# Altium schematic sheet TEC_CONTROLLER_3.SchDoc: Laser PCB
size A3; DrawnBy: James Singleton; Organization: TMC Technology Ltd.; DocumentNumber: 13; Revision: A; SheetNumber: 12; SheetTotal: 18; Drawn Date: 22/12/2020
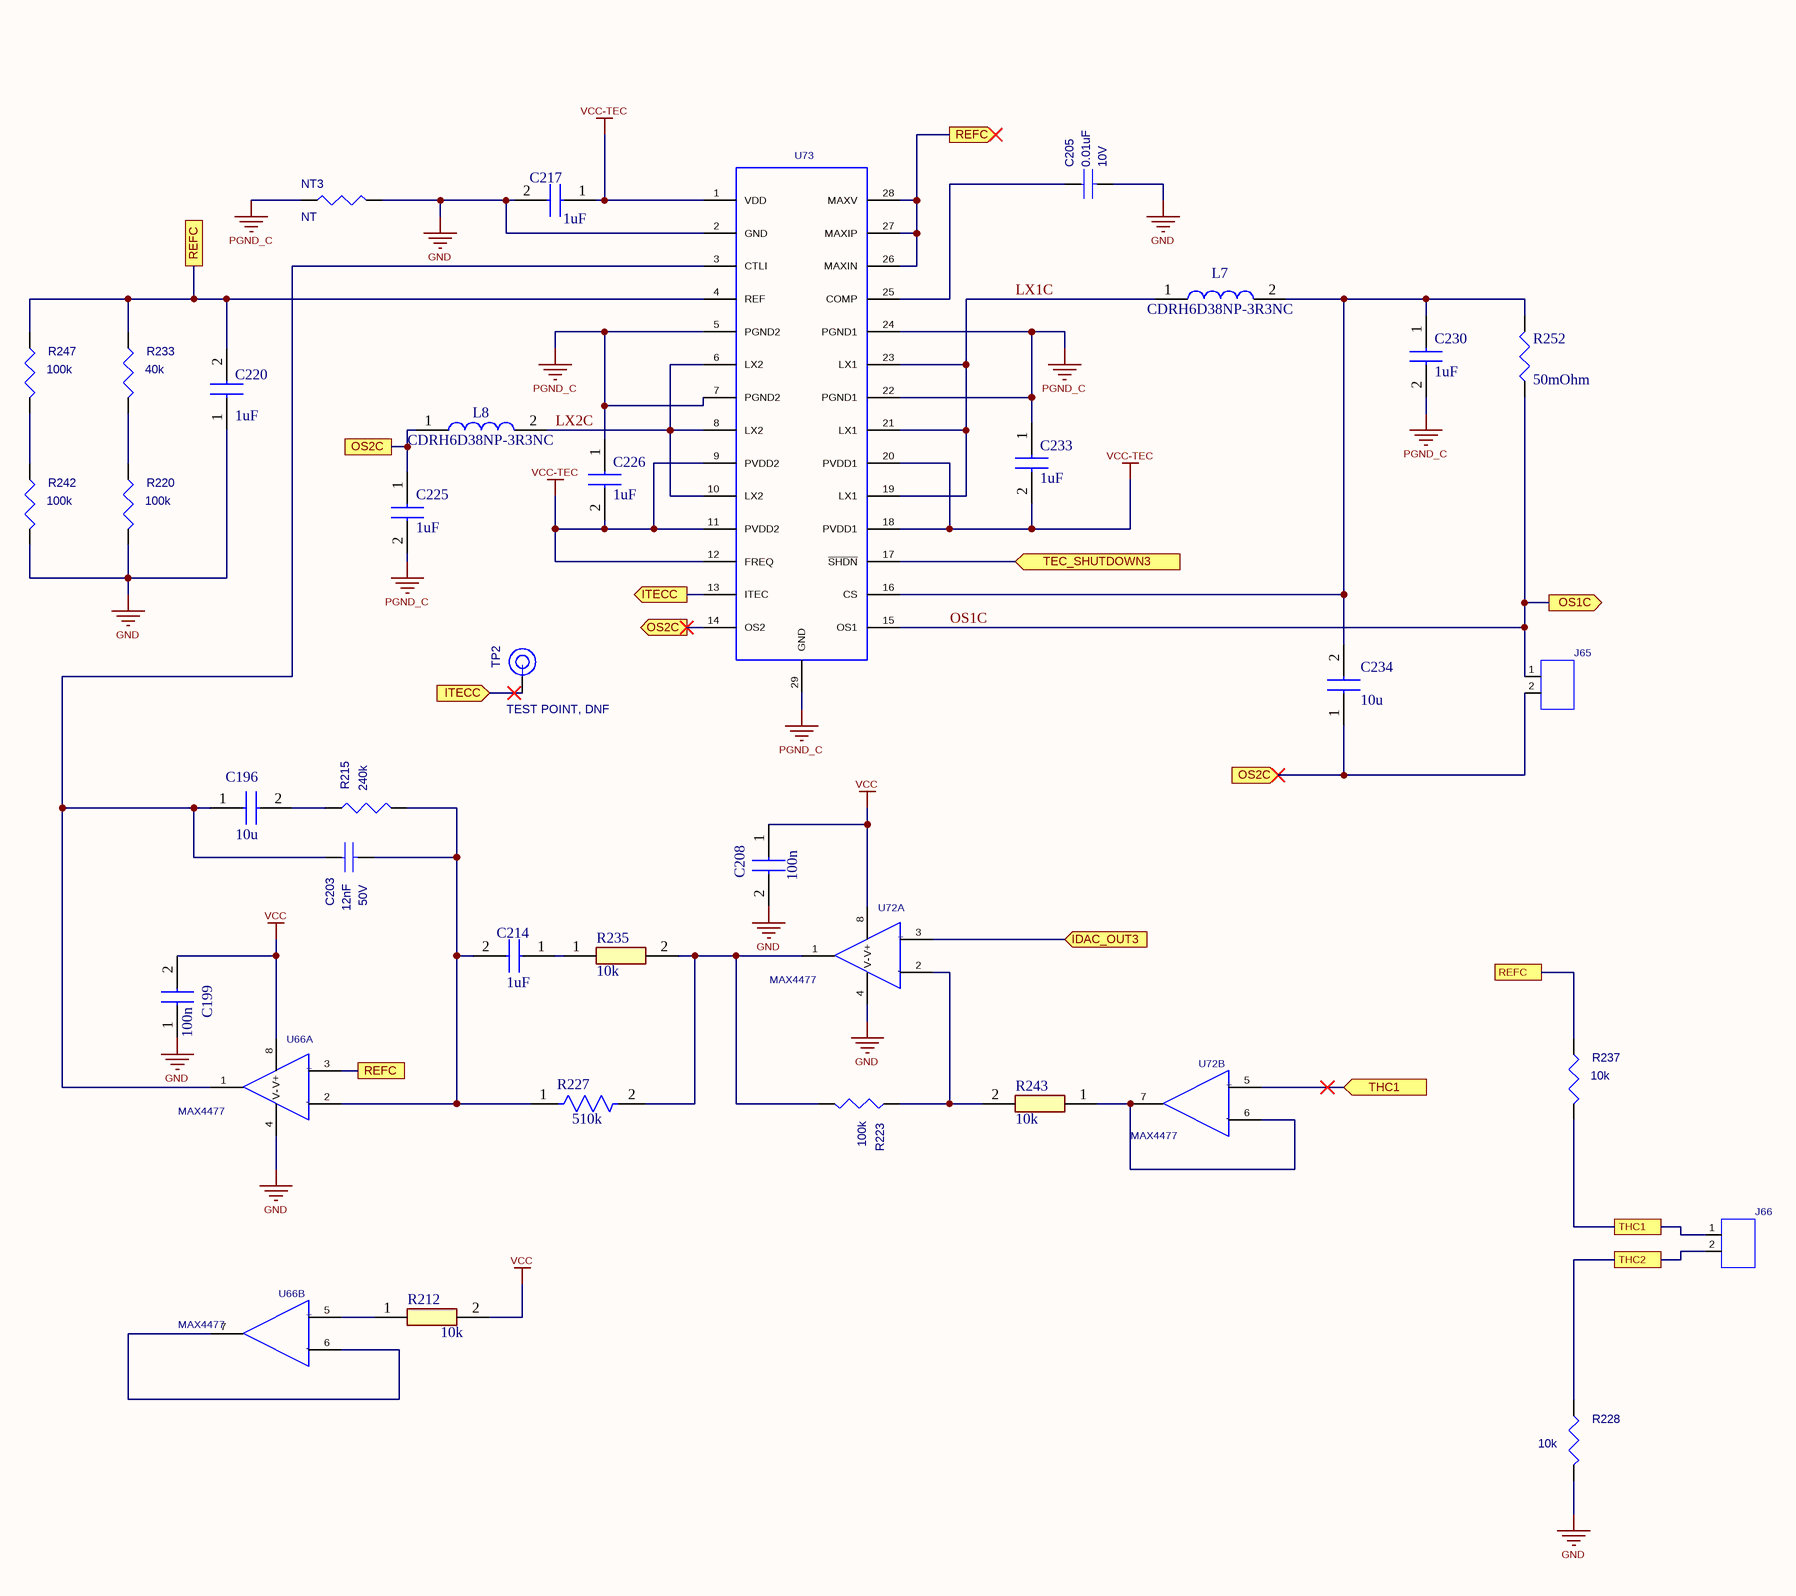
[diagram p0: TEC_CONTROLLER_3.SchDoc]

## Parts
C196  10u  [GRM18x]
C199  100n  [CAPC1608X90N]
C203  value 12nF  Rated_Voltage: 50V  [CC0603N]  (hidden comment: 12n)
C205  value 0.01uF  Rated_Voltage: 10V  [CC0603N]  (hidden comment: 10n)
C208  100n  [CAPC1608X90N]
C214  1uF  [CAPC1608X95N]
C217  1uF  [CAPC1608X95N]
C220  1uF  [CAPC1608X95N]
C225  1uF  [CAPC1608X95N]
C226  1uF  [CAPC1608X95N]
C230  1uF  [CAPC1608X95N]
C233  1uF  [CAPC1608X95N]
C234  10u  [GRM18x]
J65  CON02  [AE-6410-2W-VERTICAL]  (value not drawn)
J66  CON02  [AE-6410-2W-VERTICAL]  (value not drawn)
L7  CDRH6D38NP-3R3NC  [CDRH6D38NP3R3NC]
L8  CDRH6D38NP-3R3NC  [CDRH6D38NP3R3NC]
NT3  value NT  [NetTie]  (hidden comment: Net Tie)  (net tie, no BOM)
R212  10k  [RESC1608X55N]
R215  240k  [CR0603N]
R220  100k  [CR0603N]
R223  100k  [CR0603N]
R227  Resistance: 510k  [FP-CR0603-MFG]  (hidden comment: CR0603-JW-514ELF)
R228  value 10k  [CR0603N]  (hidden comment: RES)
R233  40k  [CR0603N]
R235  10k  [RESC1608X55N]
R237  value 10k  [CR0603N]  (hidden comment: RES)
R242  100k  [CR0603N]
R243  10k  [RESC1608X55N]
R247  100k  [CR0603N]
R252  value 50mOhm  [RESC3216X89N]  (hidden comment: PE1206FRE470R05L)
TP2  value TEST POINT, DNF  [MILLMAX3210]  (hidden comment: DNF)
U66  MAX4477  [SOP65P490X110-8CN]  (parts A,B of 2)
U72  MAX4477  [SOP65P490X110-8CN]  (parts A,B of 2)
U73  (no value)  [SOP65P638X110-29N]

## Ports
IDAC_OUT3 (in, see TEC_CONTROLLER_1[8A]), ITECC (in, see TEC_CONTROLLER_1[7C], TEC_CONTROLLER_3[3B]), ITECC (out, see TEC_CONTROLLER_1[7C], TEC_CONTROLLER_3[2B]), OS1C (out), OS2C (in, see TEC_CONTROLLER_3[2B], TEC_CONTROLLER_3[3B]), OS2C (out, see TEC_CONTROLLER_3[2B], TEC_CONTROLLER_3[5C]), OS2C (see TEC_CONTROLLER_3[3B], TEC_CONTROLLER_3[5C]), REFC (out, see TEC_CONTROLLER_3[2A], TEC_CONTROLLER_3[2C], TEC_CONTROLLER_3[6C]), REFC (see TEC_CONTROLLER_3[2A], TEC_CONTROLLER_3[2C], TEC_CONTROLLER_3[4A]), REFC (see TEC_CONTROLLER_3[2A], TEC_CONTROLLER_3[4A], TEC_CONTROLLER_3[6C]), REFC (see TEC_CONTROLLER_3[2C], TEC_CONTROLLER_3[4A], TEC_CONTROLLER_3[6C]), TEC_SHUTDOWN3 (in, see PIO[2C]), THC1 (in, see TEC_CONTROLLER_1[7C], TEC_CONTROLLER_3[6D]), THC1 (see TEC_CONTROLLER_1[7C], TEC_CONTROLLER_3[5C]), THC2

## Nets
GND: C199.1 C205.2 C208.2 C217.2 C220.1 NT3.1 R220.2 R228.2 R242.2 U66.4(V-) U72.4(V-) U73.2(GND)
PGND_C: C225.2 C226.1 C230.2 C233.1 NT3.2 U73.5(PGND2) U73.7(PGND2) U73.22(PGND1) U73.24(PGND1) U73.29(GND)
VCC: C199.2 C208.1 R212.2 U66.8(V+) U72.8(V+)
VCC-TEC: C217.1 C226.2 C233.2 U73.1(VDD) U73.9(PVDD2) U73.11(PVDD2) U73.12(FREQ) U73.18(PVDD1) U73.20(PVDD1)
IDAC_OUT3: U72.3 ; port IDAC_OUT3
ITECC: TP2.1 U73.13(ITEC) ; port ITECC
LX1C: L7.1 U73.19(LX1) U73.21(LX1) U73.23(LX1)
LX2C: L8.2 U73.6(LX2) U73.8(LX2) U73.10(LX2)
OS1C: J65.1 R252.1 U73.15(OS1) ; port OS1C
OS2C: C225.1 C234.1 J65.2 L8.1 U73.14(OS2) ; port OS2C
REFC: C220.2 R233.1 R237.1 R247.1 U66.3 U73.4(REF) U73.26(MAXIN) U73.27(MAXIP) U73.28(MAXV) ; port REFC
TEC_SHUTDOWN3: U73.17(~{SHDN}) ; port TEC_SHUTDOWN3
THC1: J66.1 R237.2 U72.5 ; port THC1
THC2: J66.2 R228.1 ; port THC2
NetC196_1: C196.1 C203.1 U66.1 U73.3(CTLI)
NetC196_2: C196.2 R215.1
NetC203_2: C203.2 C214.2 R215.2 R227.1 U66.2
NetC205_1: C205.1 U73.25(COMP)
NetC214_1: C214.1 R235.1
NetC230_1: C230.1 C234.2 L7.2 R252.2 U73.16(CS)
NetR212_1: R212.1 U66.5
NetR220_1: R220.1 R233.2
NetR223_1: R223.1 R243.2 U72.2
NetR223_2: R223.2 R227.2 R235.2 U72.1
NetR242_1: R242.1 R247.2
NetR243_1: R243.1 U72.6 U72.7
NetU66_6: U66.6 U66.7

## Notes on the sheet
- TMC Technology Ltd.
- Page Contents:
- Project:
- Variant:
- Checked By:
- Size:
- Date:
- Dwg No:
- Sheet
- of
- Revision:
- (in symbol MAX4477, part A) +; -
- (in symbol MAX4477, part B) +; -

## Library data of the parts
C196 C234 = GRM188Z71A106MA73J: Capacitor; Manufacturer_Name: Murata Electronics; Datasheet Link: https://search.murata.co.jp/Ceramy/image/img/A01X/G101/ENG/GRM188Z71A106MA73-01A.pdf; Height: 0.8mm; Manufacturer_Part_Number: GRM188Z71A106MA73J; Mouser Part Number: 81-GRM188Z71A106MA3J; Mouser Price/Stock: https://www.mouser.com/Search/Refine.aspx?Keyword=81-GRM188Z71A106MA3J; Arrow Part Number: GRM188Z71A106MA73J; Arrow Price/Stock: https://www.arrow.com/en/products/grm188z71a106ma73j/murata-manufacturing; ClassName: TEC3
C199 C208 = CL10B104KB85PNC: Capacitor; Manufacturer_Name: SAMSUNG; Datasheet Link: https://product.samsungsem.com/mlcc/CL10B104KB85PN.do; Height: 0.9mm; Manufacturer_Part_Number: CL10B104KB85PNC; Mouser Part Number: 187-CL10B104KB85PNC; Mouser Price/Stock: https://www.mouser.co.uk/ProductDetail/Samsung-Electro-Mechanics/CL10B104KB85PNC?qs=349EhDEZ59rqeQxdKfSn5w%3D%3D; Arrow Part Number: CL10B104KB85PNC; Arrow Price/Stock: https://www.arrow.com/en/products/cl10b104kb85pnc/samsung-electro-mechanics; ClassName: TEC3
C203 = CAP: Cap., 0.012µF ±10% 50V Ceramic X7R 0603 (1608 Metric); PART_NUMBER: 478-1228-1-ND; Manufacturer: AVX; Manufacturer_PN: 06035C123KAT2A; FPLIST: CC0603N,CC0603L,CC0603M; Dielectric_Type: X5R; CLASS: DISCRETE; Source_Path: \\MIL-NS1\CIP\SCHEMATIC_SYMBOLS\LTC_CAPACITOR.OLB; Geometry.Height: 37.40mil; Package_Size: 0603; Package_Type: SMD; Tolerance: 10%; PCB DECAL: CC0603N; ClassName: TEC3
C205 = CAP: CAP.,0.01uF,X5R,10V,10%,0603; Manufacturer_PN: 0603ZD103KAT2A; Manufacturer: AVX; CLASS: DISCRETE; FPLIST: CC0603N,CC0603L,CC0603M; Source_Path: \\MIL-NS1\CIP\SCHEMATIC_SYMBOLS\LTC_CAPACITOR.OLB; Geometry.Height: 37.40mil; Tolerance: 10%; Dielectric_Type: X5R; Package_Size: 0603; PCB DECAL: CC0603N; ClassName: TEC3
C214 C217 C220 C225 C226 C230 C233 = CL10B105KB8NQNC: Capacitor; Manufacturer_Name: SAMSUNG; Datasheet Link: https://product.samsungsem.com/mlcc/CL10B105KB8NQN.do; Height: 0.95mm; Manufacturer_Part_Number: CL10B105KB8NQNC; Mouser Part Number: 187-CL10B105KB8NQNC; Mouser Price/Stock: https://www.mouser.co.uk/ProductDetail/Samsung-Electro-Mechanics/CL10B105KB8NQNC?qs=Jm2GQyTW%2FbjBq1uiSyA2AQ%3D%3D; Arrow Part Number: CL10B105KB8NQNC; Arrow Price/Stock: https://www.arrow.com/en/products/cl10b105kb8nqnc/samsung-electro-mechanics?region=europe; ClassName: TEC3
J65 J66 = CON02: 2 pin Connector; Manufacturer: Molex; UNNAMED1: DNF; Order No: 1360130; PCB DECAL: AE-6410-2W-VERTICAL; Part No: 22-29-2021; ClassName: TEC3
  J66: System: Connector
L7 L8 = CDRH6D38NP-3R3NC: Inductor; Manufacturer_Name: Sumida; Datasheet Link: http://products.sumida.com/products/pdf/CDRH6D38.pdf; Manufacturer_Part_Number: CDRH6D38NP-3R3NC; Mouser Part Number: 851-CDRH6D38NP-3R3NC; Mouser Price/Stock: https://www.mouser.co.uk/ProductDetail/Sumida/CDRH6D38NP-3R3NC?qs=yEEOfDmvQDXre4MvBRE7jQ%3D%3D; Arrow Part Number: CDRH6D38NP-3R3NC; Arrow Price/Stock: https://www.arrow.com/en/products/cdrh6d38np-3R3nc/sumida?region=nac; Height: 4mm
NT3 = NetTie: Manufacturer_PN: ERJ3EKF1002V; Manufacturer: PANASONIC; Part No: P10.0KHCT-ND; PCB DECAL: CR0603N; CLASS: DISCRETE; Rated_Power: 1/10W; Tolerance: 1%; Temperature_Coefficient: 100ppm/C; FPLIST: CR0603N,CR0603L,CR0603M; Source_Path: \\MIL-NS1\CIP\SCHEMATIC_SYMBOLS\LTC_RESISTOR.OLB; Geometry.Height: 37.40mil; Package_Size: 0603
R212 R235 R243 = CR0603-JW-103ELF: Resistor; Manufacturer_Name: Bourns; Datasheet Link: https://www.bourns.com/pdfs/chpreztr.pdf; Height: 0.55mm; Manufacturer_Part_Number: CR0603-JW-103ELF; Mouser Part Number: 652-CR0603-JW-103ELF; Mouser Price/Stock: https://www.mouser.co.uk/ProductDetail/Bourns/CR0603-JW-103ELF?qs=tprK%2FdUq6q6vORSl%252Bpo4rg%3D%3D; Arrow Part Number: CR0603-JW-103ELF; Arrow Price/Stock: https://www.arrow.com/en/products/cr0603-jw-103elf/bourns?utm_currency=USD&region=nac
R215 = RES: RES.,240k OHMS,1%,1/10W,0603; Manufacturer: PANASONIC; CLASS: DISCRETE; Temperature_Coefficient: 100ppm/C; FPLIST: CR0603N,CR0603L,CR0603M; Source_Path: \\MIL-NS1\CIP\SCHEMATIC_SYMBOLS\LTC_RESISTOR.OLB; Geometry.Height: 37.40mil; PCB DECAL: CR0603N; Rated_Power: 1/10W; Tolerance: 1%; Package_Size: 0603; Value: 240k; ClassName: TEC3
R220 R223 R242 R247 = RES: RES.,100k OHMS,1%,1/10W,0603; Manufacturer_PN: ERJ3EKF1003V; Manufacturer: PANASONIC; PART_NUMBER: P100KHCT-ND; CLASS: DISCRETE; Temperature_Coefficient: 100ppm/C; FPLIST: CR0603N,CR0603L,CR0603M; Source_Path: \\MIL-NS1\CIP\SCHEMATIC_SYMBOLS\LTC_RESISTOR.OLB; Geometry.Height: 37.40mil; PCB DECAL: CR0603N; Rated_Power: 1/10W; Tolerance: 1%; Package_Size: 0603; Value: 100k; ClassName: TEC3
R227 = CMP-07231-004798-1: Thick Film Chip Resistors 0603 510kΩ 0.1W 5% 200ppm/°C; Max Power Dissipation: 100mW; Voltage Rating: 50V; Number of Terminations: 2; Radiation Hardening: No; Features: Moisture Resistant; Military Standard: Not; Width: 0.031inch; Case Code (Imperial): 0603; Tolerance: 5%; Height: 0.022inch; Min Operating Temperature: -55°C; Packaging: Tape and Reel; Case Code (Metric): 1608; Contact Plating: Tin; Mount: Surface Mount; Max Operating Temperature: 155°C; Length: 1.6mm; Temperature Coefficient: 200ppm/°C; Power Rating: 100mW; Depth: 0.8mm; Termination: SMD/SMT; Composition: Thick Film; Package Quantity: 5000; Thickness: 457um; Case/Package: 0603
R228 R237 = RES: RES.,10k OHMS,1%,1/10W,0603; Manufacturer_PN: ERJ3EKF1002V; Manufacturer: PANASONIC; Part No: P10.0KHCT-ND; CLASS: DISCRETE; Temperature_Coefficient: 100ppm/C; FPLIST: CR0603N,CR0603L,CR0603M; Source_Path: \\MIL-NS1\CIP\SCHEMATIC_SYMBOLS\LTC_RESISTOR.OLB; Geometry.Height: 37.40mil; PCB DECAL: CR0603N; Rated_Power: 1/10W; Tolerance: 1%; Package_Size: 0603; ClassName: TEC3
R233 = RES: RES.,40k OHMS,1%,1/10W,0603; Manufacturer_PN: CRCW0603560KFKEA; Manufacturer: VISHAY; PART_NUMBER: 2138575; CLASS: DISCRETE; Temperature_Coefficient: 100ppm/C; FPLIST: CR0603N,CR0603L,CR0603M; Source_Path: \\MIL-NS1\CIP\SCHEMATIC_SYMBOLS\LTC_RESISTOR.OLB; Geometry.Height: 37.40mil; PCB DECAL: CR0603N; Rated_Power: 1/10W; Tolerance: 1%; Package_Size: 0603; Value: 40k; ClassName: TEC3
R252 = PE1206FRE470R05L: Resistor; Manufacturer_Name: YAGEO; Datasheet Link: https://www.yageo.com/upload/media/product/productsearch/datasheet/rchip/PYu-PE_521_RoHS_L_10.pdf; Height: 0.89mm; Manufacturer_Part_Number: PE1206FRE470R05L; Mouser Part Number: 603-PE1206FRE470R05L; Mouser Price/Stock: https://www.mouser.co.uk/ProductDetail/YAGEO/PE1206FRE470R05L?qs=eP2BKZSCXI5fQbfM3JSqUA%3D%3D
TP2 = MILLMAX3210: TEST POINT,TURRET,0.031",MTG. HOLE; Manufacturer_PN: 3210-2-00-01-00-00-08-0; Manufacturer: MILL-MAX; PART_FIELD_01: GND; Source_Path: \\MIL-NS1\CIP\SCHEMATIC_SYMBOLS\LTC_HARDWARE.OLB; CLASS: IO; PCB DECAL: MILLMAX3210; ClassName: TEC3
U66 U72 = MAX4477: Manufacturer: Maxim; Part No: MAX4477AUA+; Geometry.Height: 1.1mm; Order No: 2510956; PCB DECAL: SOP65P490X110-8CN; ClassName: TEC3
U73 = MAX1968: Thermoelectric Cooler PMIC 28-TSSOP-EP; Part No: MAX1969; Manufacturer: Maxim; Geometry.Height: 1.1mm; Order No: 2514258; PCB DECAL: SOP65P638X110-29N; ClassName: TEC3